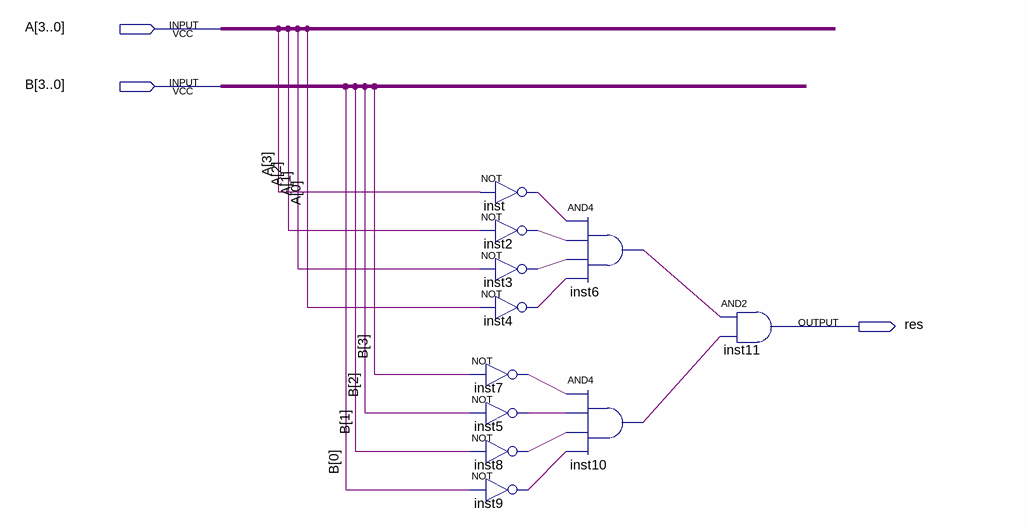
[diagram p0: schematic sheet]
// Quartus schematic isZero.bdf as structural Verilog: 11 symbols, 3 pins
module isZero (
  input  [3:0] A,
  input  [3:0] B,
  output res
);

  wire inst2_out, inst3_out, inst4_out, inst5_out, inst6_out, inst7_out, inst8_out, inst9_out, inst10_out,
       inst_out;

  not inst (inst_out, A[3]);
  not inst2 (inst2_out, A[2]);
  not inst3 (inst3_out, A[1]);
  not inst4 (inst4_out, A[0]);
  not inst7 (inst7_out, B[3]);
  not inst5 (inst5_out, B[2]);
  not inst8 (inst8_out, B[1]);
  not inst9 (inst9_out, B[0]);
  and inst6 (inst6_out, inst_out, inst2_out, inst3_out, inst4_out);
  and inst10 (inst10_out, inst7_out, inst5_out, inst8_out, inst9_out);
  and inst11 (res, inst6_out, inst10_out);
endmodule
